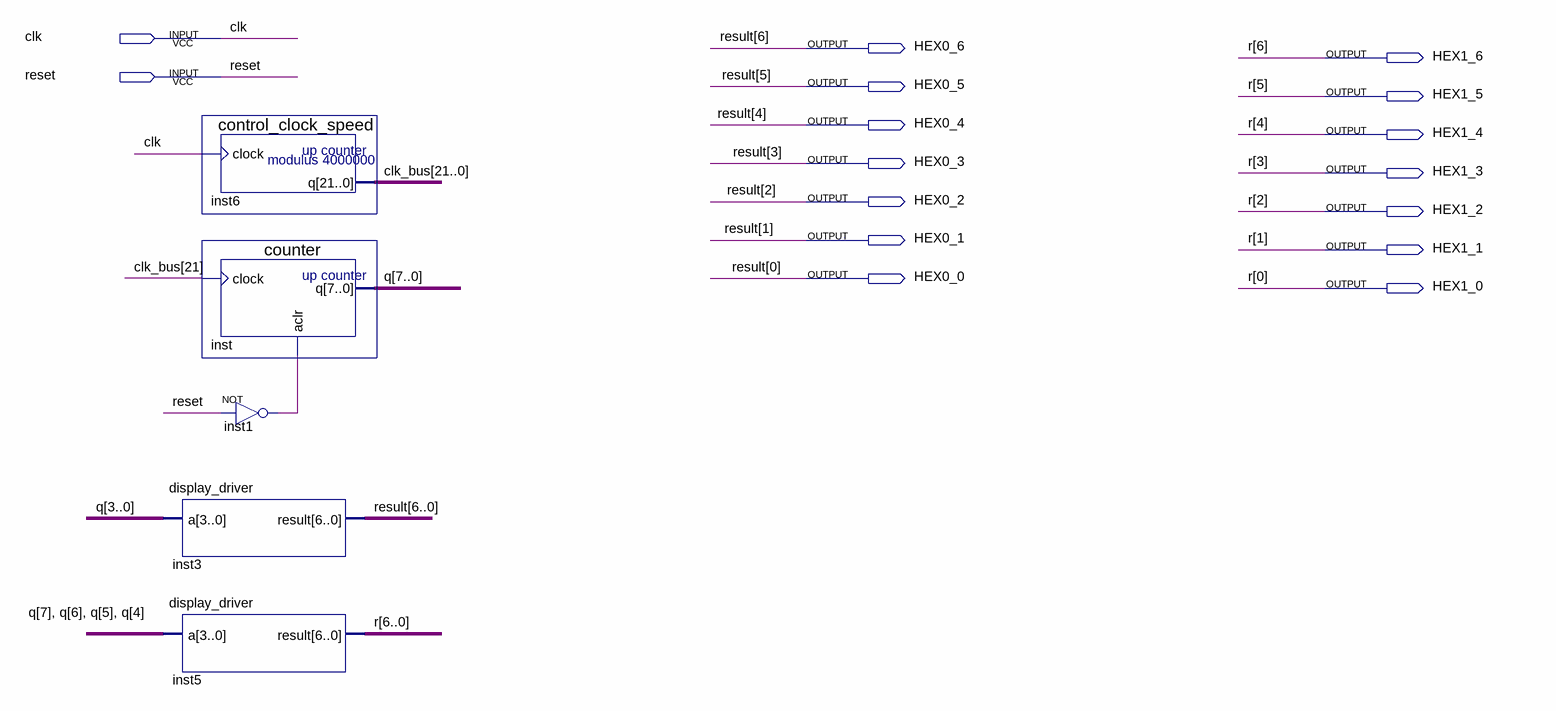
[diagram p0: schematic sheet]
// Quartus schematic display.bdf as structural Verilog: 5 symbols, 16 pins
module display (
  input  clk,
  input  reset,
  output HEX0_6,
  output HEX1_6,
  output HEX0_5,
  output HEX1_5,
  output HEX0_4,
  output HEX1_4,
  output HEX0_3,
  output HEX1_3,
  output HEX0_2,
  output HEX1_2,
  output HEX0_1,
  output HEX1_1,
  output HEX0_0,
  output HEX1_0
);

  wire inst1_out;
  wire [7:0] q;
  wire [21:0] clk_bus;

  display_driver inst3 (.a(q[3:0]), .result({HEX0_6, HEX0_5, HEX0_4, HEX0_3, HEX0_2, HEX0_1, HEX0_0}));
  display_driver inst5 (.a(q[7:4]), .result({HEX1_6, HEX1_5, HEX1_4, HEX1_3, HEX1_2, HEX1_1, HEX1_0}));
  control_clock_speed inst6 (.clock(clk), .q(clk_bus));
  counter inst (.clock(clk_bus[21]), .aclr(inst1_out), .q(q));
  not inst1 (inst1_out, reset);

  // Other names for the same wires on the sheet: r[6:0] = {HEX1_6, HEX1_5, HEX1_4, HEX1_3, HEX1_2, HEX1_1, HEX1_0};
  //   result[6:0] = {HEX0_6, HEX0_5, HEX0_4, HEX0_3, HEX0_2, HEX0_1, HEX0_0}
endmodule
